# Altium schematic sheet Peripherals.SchDoc
size A3; SheetNumber: 8; SheetTotal: 11; SPICEModelCacheDRZDZRIN: <root> / <DocumentId>DRZDZRIN</DocumentId> / </root>
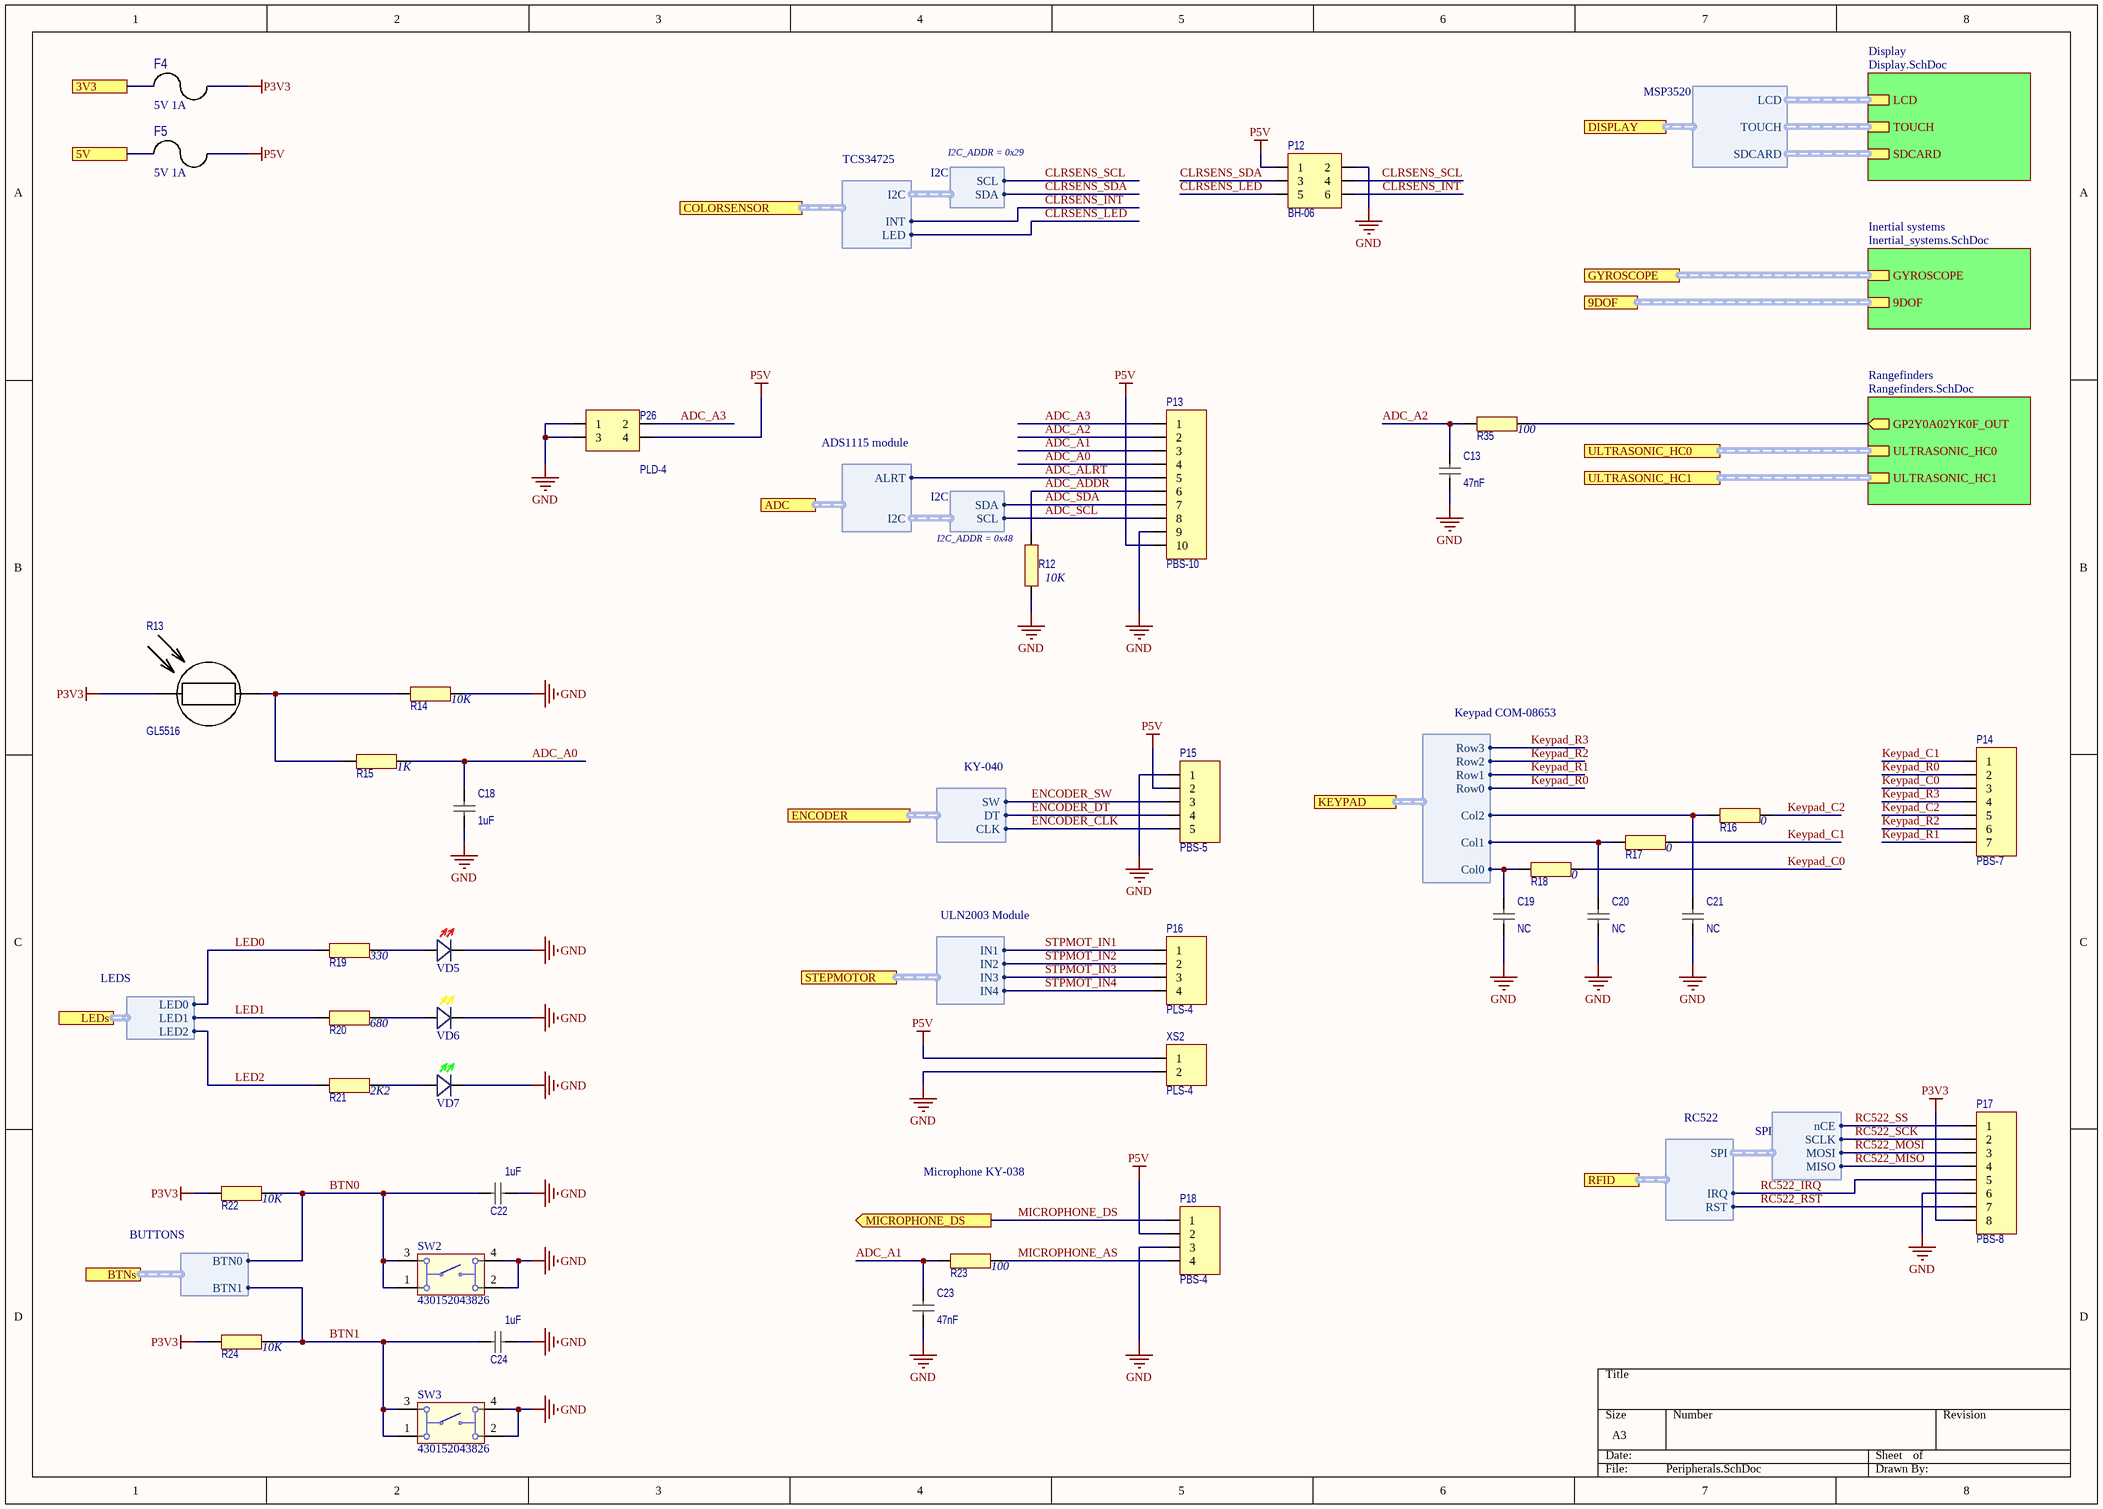
[diagram p0: Peripherals.SchDoc]

## Parts
C13  value 47nF  [C0805]  (hidden comment: C0805)
C18  value 1uF  [C0805]  (hidden comment: C0805)
C19  value NC  [C0805]  (hidden comment: C0805)
C20  value NC  [C0805]  (hidden comment: C0805)
C21  value NC  [C0805]  (hidden comment: C0805)
C22  value 1uF  [C0805]  (hidden comment: C0805)
C23  value 47nF  [C0805]  (hidden comment: C0805)
C24  value 1uF  [C0805]  (hidden comment: C0805)
F4  5V 1A  [FUSC6127X269N]
F5  5V 1A  [FUSC6127X269N]
P12  BH-06  [BH-06]
P13  PBS-10  [PBS-10]
P14  PBS-7  [PBS-7]
P15  PBS-5  [PBS-5]
P16  PLS-4  [PLS-4]
P17  PBS-8  [PBS-8]
P18  PBS-4  [PBS-4]
P26  PLD-4  [PLD-4]
R12  value 10K  [R0805]  (hidden comment: R0805)
R13  GL5516  [GL5516]
R14  value 10K  [R0805]  (hidden comment: R0805)
R15  value 1K  [R0805]  (hidden comment: R0805)
R16  value 0  [R0805]  (hidden comment: R0805)
R17  value 0  [R0805]  (hidden comment: R0805)
R18  value 0  [R0805]  (hidden comment: R0805)
R19  value 330  [R0805]  (hidden comment: R0805)
R20  value 680  [R0805]  (hidden comment: R0805)
R21  value 2K2  [R0805]  (hidden comment: R0805)
R22  value 10K  [R0805]  (hidden comment: R0805)
R23  value 100  [R0805]  (hidden comment: R0805)
R24  value 10K  [R0805]  (hidden comment: R0805)
R35  value 100  [R0805]  (hidden comment: R0805)
SW2  430152043826  [430152043826]
SW3  430152043826  [430152043826]
VD5  TO-1608BC-MRE  [TO-1608BC-MRE]  (value not drawn)
VD6  TO-1608BC-MYF  [TO-1608BC-MYF]  (value not drawn)
VD7  TO-1608BC-PG  [TO-1608BC-PG]  (value not drawn)
XS2  PLS-4  [PLS-2]

## Sub-sheets
Display = Display.SchDoc: SDCARD (harness SPI), TOUCH (harness TOUCH), LCD (harness LCD)
Inertial systems = Inertial_systems.SchDoc: GYROSCOPE (harness GY-50 L3GD20 Gyro), 9DOF (harness 9DOF)
Rangefinders = Rangefinders.SchDoc: ULTRASONIC_HC0 (harness HC-SR04), ULTRASONIC_HC1 (harness HC-SR04), GP2Y0A02YK0F_OUT (out)

## Ports
3V3, 5V, 9DOF (harness 9DOF), ADC (harness ADS1115 module), BTNs (harness BUTTONS), COLORSENSOR (harness TCS34725), DISPLAY (harness MSP3520), ENCODER (harness KY-040), GYROSCOPE (harness GY-50 L3GD20 Gyro), KEYPAD (harness Keypad COM-08653), LEDs (harness LEDS), MICROPHONE_DS (out), RFID (harness RC522), STEPMOTOR (harness ULN2003 Module), ULTRASONIC_HC0 (harness HC-SR04), ULTRASONIC_HC1 (harness HC-SR04)

## Harnesses
RC522: IRQ, RST, SPI
Keypad COM-08653: Col0, Col1, Col2, Row0, Row1, Row2, Row3
KY-040: CLK, SW, DT
ADS1115 module: I2C, ALRT
ULN2003 Module: IN1, IN2, IN3, IN4
BUTTONS: BTN0, BTN1
LEDS: LED0, LED1, LED2
I2C: SCL, SDA
SPI: nCE, MISO, MOSI, SCLK
MSP3520: LCD, TOUCH, SDCARD
TCS34725: I2C, INT, LED

## Nets
GND: C13.1 C18.1 C19.1 C20.1 C21.1 C22.1 C23.1 C24.1 P12.2 P13.9 P15.1 P17.6 P18.3 P26.1 P26.3 R12.2 R14.1 SW2.2 SW2.4 SW3.2 SW3.4 VD5.- VD6.- VD7.- XS2.2
P3V3: F4.2 P17.8 R13.1 R22.2 R24.2
P5V: F5.2 P12.1 P13.10 P15.2 P18.2 P26.4 XS2.1
3V3: F4.1 ; port 3V3
5V: F5.1 ; port 5V
ADC_A0: C18.2 P13.4 R15.1
ADC_A1: C23.2 P13.3 R23.2
ADC_A2: C13.2 P13.2 R35.2
ADC_A3: P13.1 P26.2
ADC_ADDR: P13.6 R12.1
ADC_ALRT: P13.5 ; port ADC.ALRT
ADC_SCL: P13.8 ; harness I2C.SCL
ADC_SDA: P13.7 ; harness I2C.SDA
BTN0: C22.2 R22.1 SW2.1 SW2.3 ; port BTNs.BTN0
BTN1: C24.2 R24.1 SW3.1 SW3.3 ; port BTNs.BTN1
CLRSENS_INT: P12.6 ; port COLORSENSOR.INT
CLRSENS_LED: P12.5
CLRSENS_SCL: P12.4 ; harness I2C.SCL
CLRSENS_SDA: P12.3 ; harness I2C.SDA
ENCODER_CLK: P15.5 ; port ENCODER.CLK
ENCODER_DT: P15.4 ; port ENCODER.DT
ENCODER_SW: P15.3 ; port ENCODER.SW
Keypad_C0: P14.3 R18.1
Keypad_C1: P14.1 R17.1
Keypad_C2: P14.5 R16.1
Keypad_R0: P14.2 ; port KEYPAD.Row0
Keypad_R1: P14.7 ; port KEYPAD.Row1
Keypad_R2: P14.6 ; port KEYPAD.Row2
Keypad_R3: P14.4 ; port KEYPAD.Row3
LED0: R19.2 ; port LEDs.LED0
LED1: R20.2 ; port LEDs.LED1
LED2: R21.2 ; port LEDs.LED2
MICROPHONE_AS: P18.4 R23.1
MICROPHONE_DS: P18.1 ; port MICROPHONE_DS
RC522_IRQ: P17.5 ; port RFID.IRQ
RC522_MISO: P17.4 ; harness SPI.MISO
RC522_MOSI: P17.3 ; harness SPI.MOSI
RC522_RST: P17.7 ; port RFID.RST
RC522_SCK: P17.2 ; harness SPI.SCLK
RC522_SS: P17.1 ; harness SPI.nCE
STPMOT_IN1: P16.1 ; port STEPMOTOR.IN1
STPMOT_IN2: P16.2 ; port STEPMOTOR.IN2
STPMOT_IN3: P16.3 ; port STEPMOTOR.IN3
STPMOT_IN4: P16.4 ; port STEPMOTOR.IN4
NetC19_2: C19.2 R18.2 ; port KEYPAD.Col0
NetC20_2: C20.2 R17.2 ; port KEYPAD.Col1
NetC21_2: C21.2 R16.2 ; port KEYPAD.Col2
NetR13_2: R13.2 R14.2 R15.2
NetR19_1: R19.1 VD5.+
NetR20_1: R20.1 VD6.+
NetR21_1: R21.1 VD7.+
NetR35_1: R35.1 ; sheet Rangefinders/GP2Y0A02YK0F_OUT

## Buses and harness runs
harness port 9DOF = sheet Inertial systems/9DOF
harness port GYROSCOPE = sheet Inertial systems/GYROSCOPE
harness port ULTRASONIC_HC0 = sheet Rangefinders/ULTRASONIC_HC0
harness port ULTRASONIC_HC1 = sheet Rangefinders/ULTRASONIC_HC1

## Notes on the sheet
- I2C_ADDR = 0x29
- (near R12) I2C_ADDR = 0x48
- Microphone KY-038

## Library data of the parts
C13 C18-C24 = C0805: Tolerance: %; Voltage: B; Case: *; Dielectric: *; Mount: *; PartNumber: *
F4 F5 = F: 045303.5MR
R13 = Light Sensor: PartNumber: GL5516
SW2 SW3 = 430152043826: WS-TASV SMD Tact Switch 6X6 mm; NoPins: 04; PackageReference: 430152043826; PartNumber: 430152043826; ComponentLink1Description: Manufacturer URL; ComponentLink1URL: http://www.we-online.com; ComponentLink2Description: Datasheet; ComponentLink2URL: http://katalog.we-online.de/em/datasheet/4301x2.pdf
VD5 = TO-1608BC-MRE: LED SMD 1608 112мКд, 120°, 630нМ (Ultra Bright Red)
VD6 = TO-1608BC-MYF: LED SMD 1608 247мКд, 120°, 592нМ (High Bright Yellow)
VD7 = TO-1608BC-PG: LED SMD 1608 705мКд, 120°, 525нМ (Pure Green)
XS2 = PLS-2
R12 R14-R24 R35 = R0805: Case: *; Mount: *; PartNumber: *; Power: *; Tolerance: *